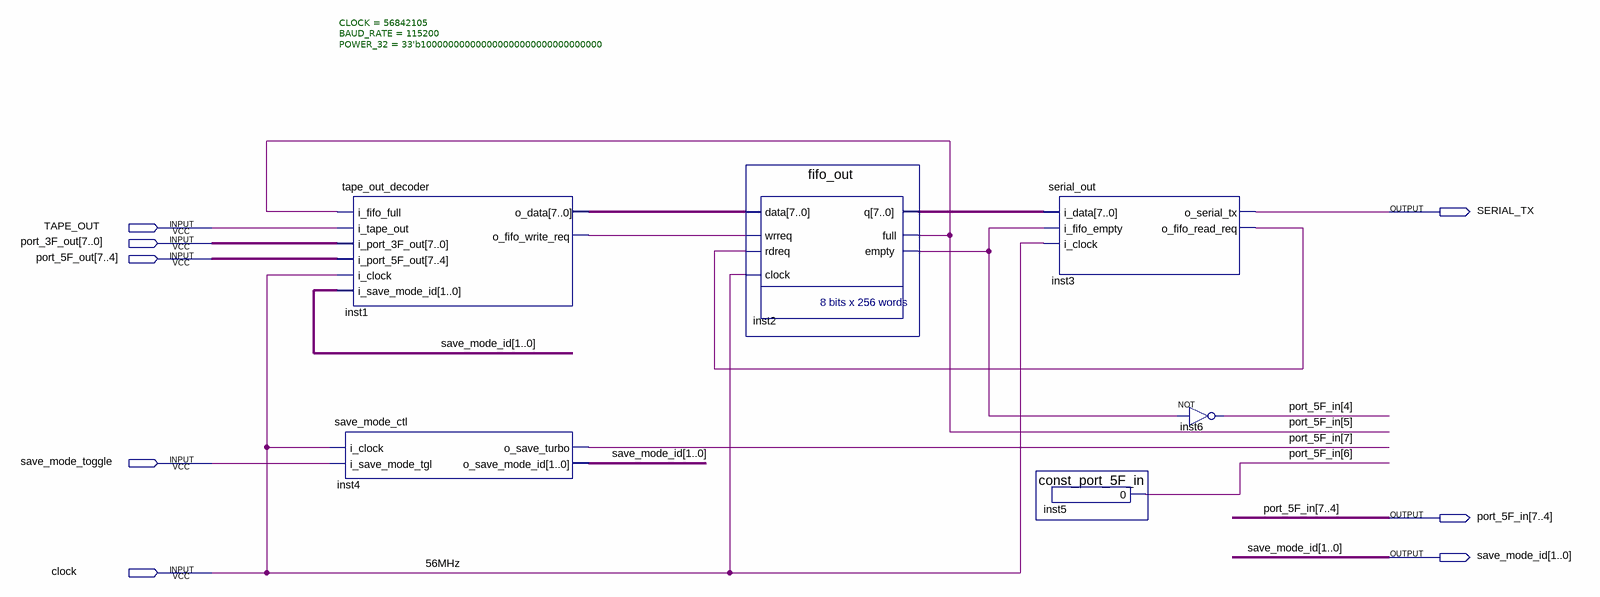
[diagram p0: schematic sheet]
// Quartus schematic tape_writer.bdf as structural Verilog: 6 symbols, 8 pins
module tape_writer (
  input  TAPE_OUT,
  input  [7:0] port_3F_out,
  input  [7:4] port_5F_out,
  input  save_mode_toggle,
  input  clock,
  output SERIAL_TX,
  output [7:4] port_5F_in,
  output [1:0] save_mode_id
);

  wire inst1_o_fifo_write_req, inst2_empty, inst3_o_fifo_read_req;
  wire [7:0] inst1_o_data, inst2_q;

  tape_out_decoder inst1 (
    .i_fifo_full(port_5F_in[5]), .i_tape_out(TAPE_OUT), .i_port_3F_out(port_3F_out),
    .i_port_5F_out(port_5F_out), .i_clock(clock), .i_save_mode_id(save_mode_id), .o_data(inst1_o_data),
    .o_fifo_write_req(inst1_o_fifo_write_req));
  save_mode_ctl inst4 (
    .i_clock(clock), .i_save_mode_tgl(save_mode_toggle), .o_save_turbo(port_5F_in[7]),
    .o_save_mode_id(save_mode_id));
  fifo_out inst2 (
    .data(inst1_o_data), .wrreq(inst1_o_fifo_write_req), .rdreq(inst3_o_fifo_read_req), .clock(clock),
    .q(inst2_q), .full(port_5F_in[5]), .empty(inst2_empty));
  serial_out #(.CLOCK(56842105), .BAUD_RATE(115200), .POWER_32(33'b100000000000000000000000000000000)) inst3 (
    .i_data(inst2_q), .i_fifo_empty(inst2_empty), .i_clock(clock), .o_serial_tx(SERIAL_TX),
    .o_fifo_read_req(inst3_o_fifo_read_req));
  const_port_5F_in inst5 (.result(port_5F_in[6]));
  not inst6 (port_5F_in[4], inst2_empty);

  // Other names for the same wires on the sheet: 56MHz = clock
endmodule
